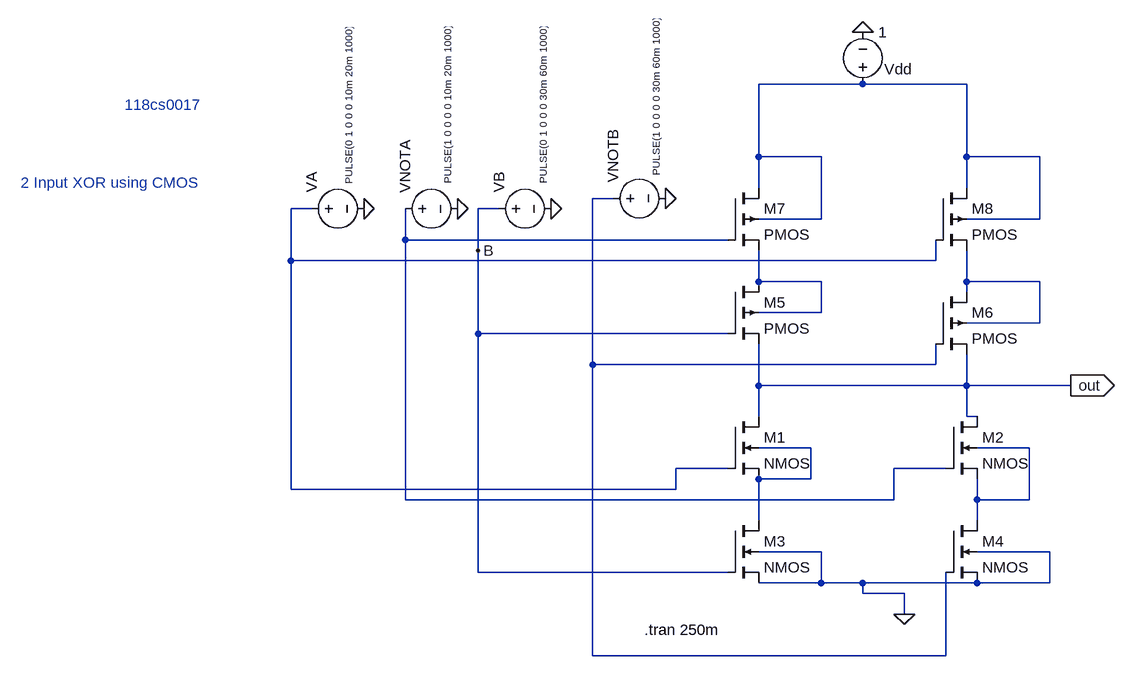
[diagram p0: schematic Draft6.asc]
Draft6.asc, the LTspice schematic file:
Version 4
SHEET 1 1256 680
WIRE 272 -336 112 -336
WIRE 432 -336 272 -336
WIRE 112 -224 112 -336
WIRE 208 -224 112 -224
WIRE 432 -224 432 -336
WIRE 544 -224 432 -224
WIRE 112 -176 112 -224
WIRE 432 -176 432 -224
WIRE -112 -160 -144 -160
WIRE -576 -144 -608 -144
WIRE -288 -144 -320 -144
WIRE 208 -128 208 -224
WIRE 208 -128 112 -128
WIRE 544 -128 544 -224
WIRE 544 -128 432 -128
WIRE -432 -96 -432 -144
WIRE 64 -96 -432 -96
WIRE -320 -80 -320 -144
WIRE -608 -64 -608 -144
WIRE 384 -64 384 -96
WIRE 384 -64 -608 -64
WIRE 112 -32 112 -80
WIRE 208 -32 112 -32
WIRE 432 -32 432 -80
WIRE 544 -32 432 -32
WIRE 432 -16 432 -32
WIRE 208 16 208 -32
WIRE 208 16 112 16
WIRE 544 32 544 -32
WIRE 544 32 432 32
WIRE -320 48 -320 -80
WIRE 64 48 -320 48
WIRE -144 96 -144 -160
WIRE 384 96 384 64
WIRE 384 96 -144 96
WIRE 112 128 112 64
WIRE 432 128 432 80
WIRE 432 128 112 128
WIRE 592 128 432 128
WIRE 112 176 112 128
WIRE 432 176 432 128
WIRE 448 176 432 176
WIRE 192 224 112 224
WIRE 528 224 448 224
WIRE 64 256 -16 256
WIRE 400 256 320 256
WIRE 192 272 192 224
WIRE 192 272 112 272
WIRE -608 288 -608 -64
WIRE -16 288 -16 256
WIRE -16 288 -608 288
WIRE -432 304 -432 -96
WIRE 320 304 320 256
WIRE 320 304 -432 304
WIRE 448 304 448 272
WIRE 528 304 528 224
WIRE 528 304 448 304
WIRE 112 336 112 272
WIRE 448 336 448 304
WIRE 208 384 112 384
WIRE 560 384 448 384
WIRE -320 416 -320 48
WIRE 64 416 -320 416
WIRE 208 432 208 384
WIRE 208 432 112 432
WIRE 272 432 208 432
WIRE 448 432 272 432
WIRE 560 432 560 384
WIRE 560 432 448 432
WIRE 272 448 272 432
WIRE 336 448 272 448
WIRE 336 480 336 448
WIRE -144 544 -144 96
WIRE 400 544 400 416
WIRE 400 544 -144 544
FLAG 336 480 0
FLAG -320 -80 B
FLAG -496 -144 0
FLAG -352 -144 0
FLAG 592 128 out
IOPIN 592 128 Out
FLAG -208 -144 0
FLAG -32 -160 0
FLAG 272 -416 0
SYMBOL nmos4 64 176 R0
SYMATTR InstName M1
SYMBOL nmos4 400 176 R0
SYMATTR InstName M2
SYMBOL nmos4 400 336 R0
SYMATTR InstName M4
SYMBOL pmos4 384 -16 R0
SYMATTR InstName M6
SYMBOL pmos4 64 -176 R0
SYMATTR InstName M7
SYMBOL pmos4 384 -176 R0
SYMATTR InstName M8
SYMBOL voltage 272 -320 M180
WINDOW 0 33 39 Left 2
WINDOW 123 0 0 Left 0
WINDOW 39 0 0 Left 0
SYMATTR InstName Vdd
SYMATTR Value 1
SYMBOL voltage -592 -144 R270
WINDOW 3 38 73 Left 1
WINDOW 123 0 0 Left 0
WINDOW 39 0 0 Left 0
SYMATTR Value PULSE(0 1 0 0 0 10m 20m 1000)
SYMATTR InstName VA
SYMBOL voltage -448 -144 R270
WINDOW 3 39 81 Left 1
WINDOW 123 0 0 Left 0
WINDOW 39 0 0 Left 0
SYMATTR Value PULSE(1 0 0 0 0 10m 20m 1000)
SYMATTR InstName VNOTA
SYMBOL voltage -304 -144 R270
WINDOW 3 39 84 Left 1
WINDOW 123 0 0 Left 0
WINDOW 39 0 0 Left 0
SYMATTR Value PULSE(0 1 0 0 0 30m 60m 1000)
SYMATTR InstName VB
SYMBOL voltage -128 -160 R270
WINDOW 3 35 82 Left 1
WINDOW 123 0 0 Left 0
WINDOW 39 0 0 Left 0
SYMATTR Value PULSE(1 0 0 0 0 30m 60m 1000)
SYMATTR InstName VNOTB
SYMBOL pmos4 64 -32 R0
SYMATTR InstName M5
SYMBOL nmos4 64 336 R0
SYMATTR InstName M3
TEXT -64 504 Left 2 !.tran 250m
TEXT -864 -304 Left 2 ;118cs0017
TEXT -1024 -184 Left 2 ;2 Input XOR using CMOS

The netlist it stands for:
* Draft6.asc
M1 out N003 N007 N007 NMOS
M2 out N004 N008 N008 NMOS
M4 N008 N002 0 0 NMOS
M6 N006 N002 out N006 PMOS
M7 N001 N004 N005 N001 PMOS
M8 N001 N003 N006 N001 PMOS
Vdd N001 0 1
VA N003 0 PULSE(0 1 0 0 0 10m 20m 1000)
VNOTA N004 0 PULSE(1 0 0 0 0 10m 20m 1000)
VB B 0 PULSE(0 1 0 0 0 30m 60m 1000)
VNOTB N002 0 PULSE(1 0 0 0 0 30m 60m 1000)
M5 N005 B out N005 PMOS
M3 N007 B 0 0 NMOS
.model NMOS NMOS
.model PMOS PMOS
.lib standard.mos
.tran 250m
* 118cs0017
* 2 Input XOR using CMOS
.backanno
.end